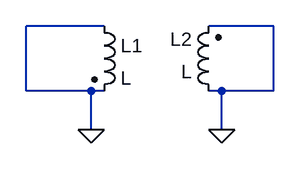
[diagram p0: schematic Draft3.asc]
Draft3.asc, the LTspice schematic file:
Version 4
SHEET 1 880 680
WIRE 144 128 48 128
WIRE 352 128 272 128
WIRE 48 208 48 128
WIRE 128 208 48 208
WIRE 144 208 128 208
WIRE 288 208 272 208
WIRE 352 208 352 128
WIRE 352 208 288 208
WIRE 128 256 128 208
WIRE 288 256 288 208
FLAG 128 256 0
FLAG 288 256 0
SYMBOL ind2 128 112 R0
SYMATTR InstName L1
SYMBOL ind2 288 224 R180
WINDOW 0 36 80 Left 2
WINDOW 3 36 40 Left 2
SYMATTR InstName L2

The netlist it stands for:
* Draft3.asc
L1 0 0 L
L2 0 0 L
.backanno
.end